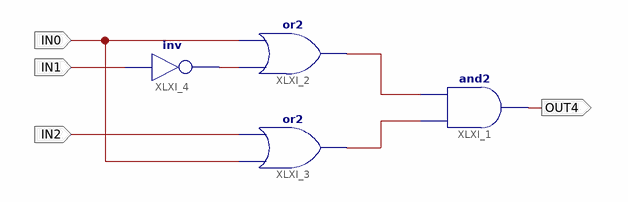
[diagram p0: schematic sheet 1]
// Xilinx ISE schematic Segmento4.sch (spartan3e) as structural Verilog: 4 symbols, 4 ports
module Segmento4 (
  input  IN2,
  input  IN1,
  input  IN0,
  output OUT4
);

  wire XLXN_2, XLXN_3, XLXN_10;

  and XLXI_1 (OUT4, XLXN_3, XLXN_2);
  or XLXI_2 (XLXN_2, XLXN_10, IN0);
  or XLXI_3 (XLXN_3, IN0, IN2);
  not XLXI_4 (XLXN_10, IN1);
endmodule
